# EAGLE design 808_hihat (EAGLE 7.2.0)
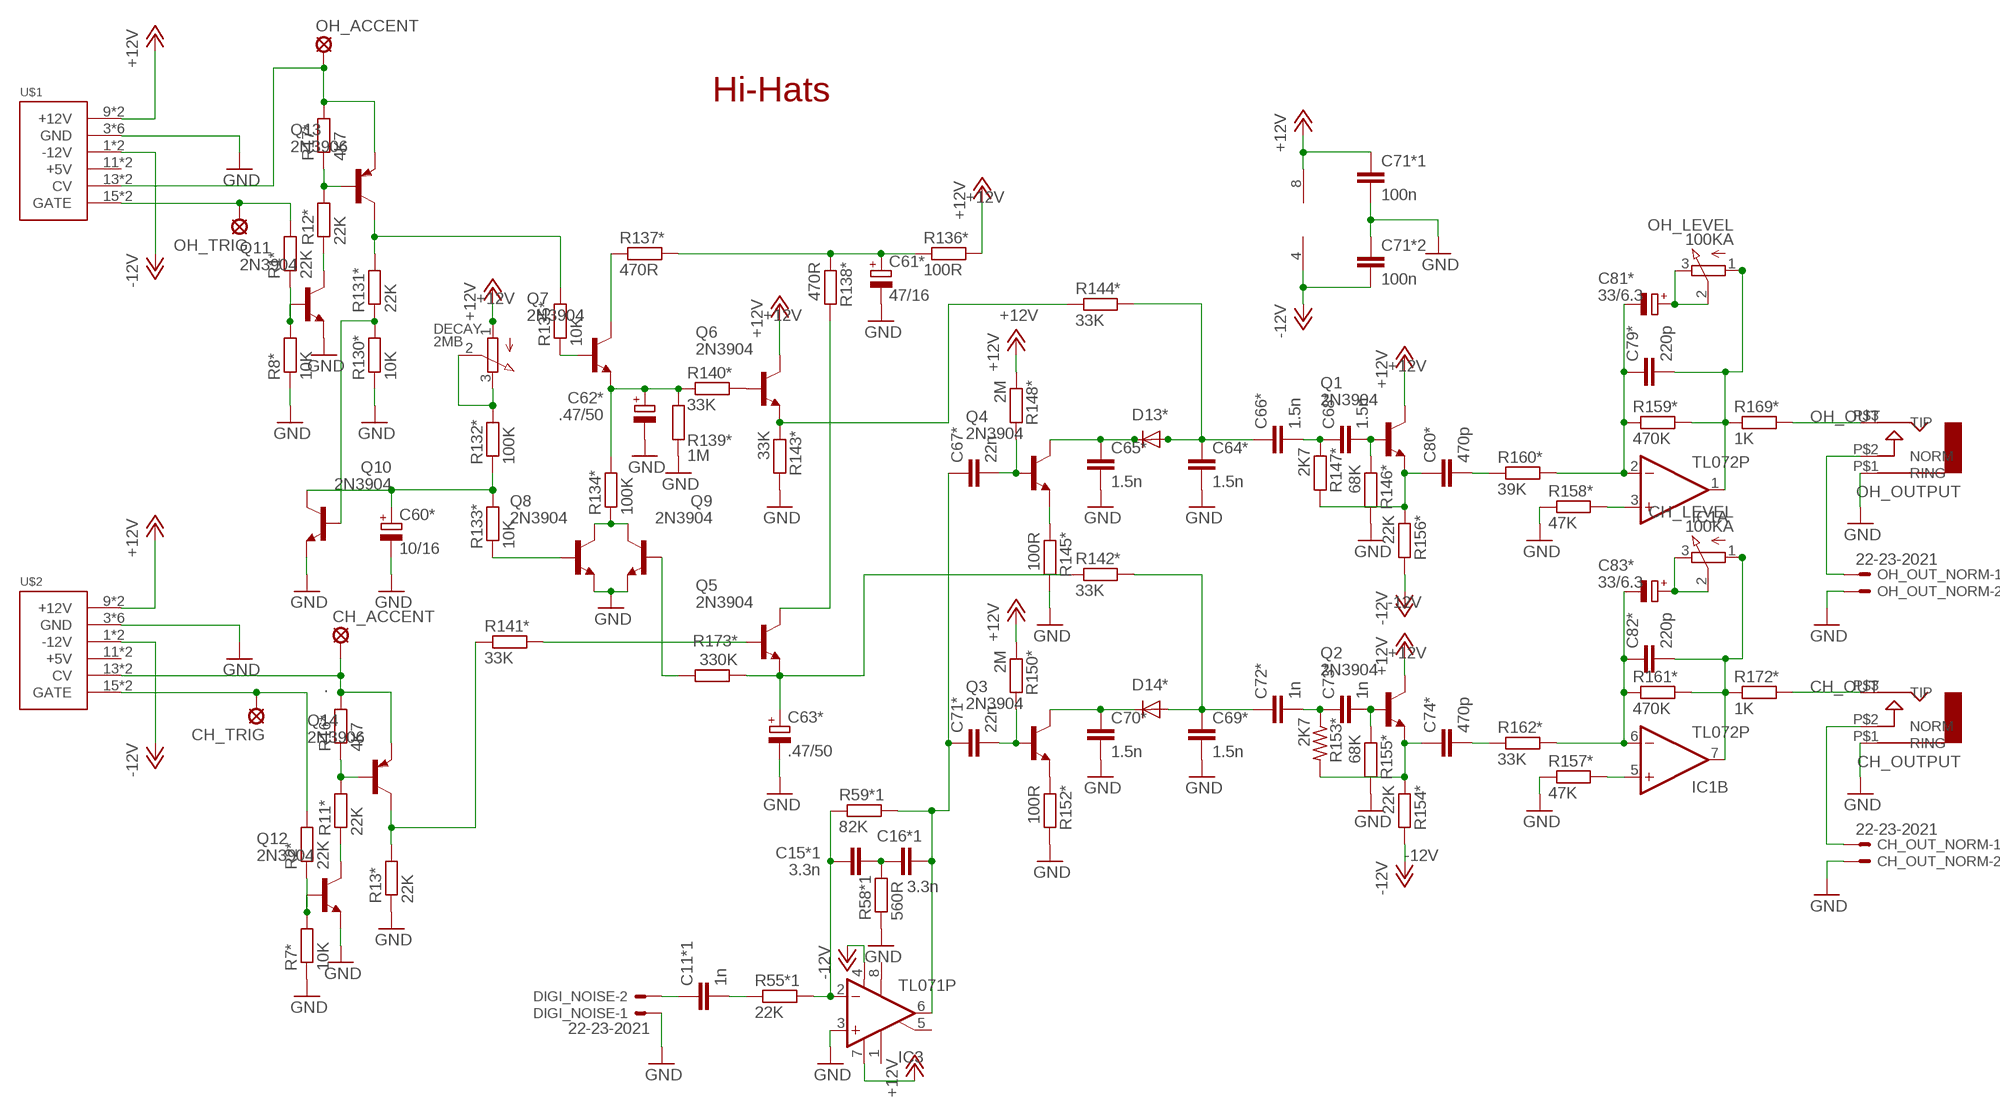
[diagram p0: schematic, sheet 1]

## Parts
C11*1  1n  C-EU3.5MM_PITCH  [C035-025X75]
C15*1  3.3n  C-EU050-024X044  [C050-024X044]
C16*1  3.3n  C-EU3.5MM_PITCH  [C035-025X75]
C60*  10/16  CPOL-EUE2.5-5  [E2,5-5]
C61*  47/16  CPOL-EUE2.5-5  [E2,5-5]
C62*  .47/50  CPOL-EUE2.5-5  [E2,5-5]
C63*  .47/50  CPOL-EUE2.5-5  [E2,5-5]
C64*  1.5n  C-EU050-024X044  [C050-024X044]
C65*  1.5n  C-EU3.5MM_PITCH  [C035-025X75]
C66*  1.5n  C-EU050-024X044  [C050-024X044]
C67*  22n  C-EU050-024X044  [C050-024X044]
C68*  1.5n  C-EU050-025X075  [C050-025X075]
C69*  1.5n  C-EU050-024X044  [C050-024X044]
C70*  1.5n  C-EU3.5MM_PITCH  [C035-025X75]
C71*  22n  C-EU4MM_PITCH  [C035-030X60]
C71*1  100n  C-EU050-024X044  [C050-024X044]
C71*2  100n  C-EU3MM_PITCH  [C030-025X75]
C72*  1n  C-EU050-024X044  [C050-024X044]
C73*  1n  C-EU050-024X044  [C050-024X044]
C74*  470p  C-EU050-025X075  [C050-025X075]
C79*  220p  C-EU025-025X050  [C025-025X050]
C80*  470p  C-EU050-024X044  [C050-024X044]
C81*  33/6.3  CPOL-EUE3.5-8  [E3,5-8]
C82*  220p  C-EU025-025X050  [C025-025X050]
C83*  33/6.3  CPOL-EUE2-5  [E2-5]
CH_ACCENT  LSP11  [LSP11]
CH_LEVEL  100KA  3RP/1610N  [3RP/1610N]
CH_OUT_NORM  22-23-2021  [22-23-2021]
CH_OUTPUT  AUDIO-JACK  [ERTHENVAR-JACK-90DEG]
CH_TRIG  LSP11  [LSP11]
D13*  1N4148DO35-10  [DO35-10]
D14*  1N4148DO35-10  [DO35-10]
DECAY  2MB  3RP/1610N  [3RP/1610N]
DIGI_NOISE  22-23-2021  [22-23-2021]
IC1  TL072P  [DIL08]
IC3  TL071P  [DIL08]
OH_ACCENT  LSP11  [LSP11]
OH_LEVEL  100KA  3RP/1610N  [3RP/1610N]
OH_OUT_NORM  22-23-2021  [22-23-2021]
OH_OUTPUT  AUDIO-JACK  [ERTHENVAR-JACK-90DEG]
OH_TRIG  LSP11  [LSP11]
Q1  2N3904  [TO92]
Q2  2N3904  [TO92]
Q3  2N3904  [TO92]
Q4  2N3904  [TO92]
Q5  2N3904  [TO92]
Q6  2N3904  [TO92]
Q7  2N3904  [TO92]
Q8  2N3904  [TO92]
Q9  2N3904  [TO92]
Q10  2N3904  [TO92]
Q11  2N3904  [TO92]
Q12  2N3904  [TO92]
Q13  2N3906  [TO92]
Q14  2N3906  [TO92]
R1*  22K  R-EU_0207/2V  [0207/2V]
R2*  22K  R-EU_0207/5V  [0207/5V]
R7*  10K  R-EU_0207/5V  [0207/5V]
R8*  10K  R-EU_0207/5V  [0207/5V]
R11*  22K  R-EU_0207/7  [0207/7]
R12*  22K  R-EU_0207/7  [0207/7]
R13*  22K  R-EU_0207/5V  [0207/5V]
R16*  4K7  R-EU_0207/5V  [0207/5V]
R17*  4K7  R-EU_0207/5V  [0207/5V]
R55*1  22K  R-EU_0207/5V  [0207/5V]
R58*1  560R  R-EU_0207/5V  [0207/5V]
R59*1  82K  R-EU_0207/7  [0207/7]
R130*  10K  R-EU_0207/7  [0207/7]
R131*  22K  R-EU_0207/5V  [0207/5V]
R132*  100K  R-EU_0207/5V  [0207/5V]
R133*  10K  R-EU_0207/7  [0207/7]
R134*  100K  R-EU_0207/7  [0207/7]
R135*  10K  R-EU_0207/7  [0207/7]
R136*  100R  R-EU_0207/5V  [0207/5V]
R137*  470R  R-EU_0207/5V  [0207/5V]
R138*  470R  R-EU_0207/5V  [0207/5V]
R139*  1M  R-EU_0207/5V  [0207/5V]
R140*  33K  R-EU_0207/7  [0207/7]
R141*  33K  R-EU_0207/5V  [0207/5V]
R142*  33K  R-EU_0207/5V  [0207/5V]
R143*  33K  R-EU_0207/5V  [0207/5V]
R144*  33K  R-EU_0207/5V  [0207/5V]
R145*  100R  R-EU_0207/5V  [0207/5V]
R146*  68K  R-EU_0207/7  [0207/7]
R147*  2K7  R-EU_0309/10  [0309/10]
R148*  2M  R-EU_0207/5V  [0207/5V]
R150*  2M  R-EU_0207/5V  [0207/5V]
R152*  100R  R-EU_0207/5V  [0207/5V]
R153*  2K7  R-US_0207/5V  [0207/5V]
R154*  22K  R-EU_0207/5V  [0207/5V]
R155*  68K  R-EU_0207/7  [0207/7]
R156*  22K  R-EU_0207/7  [0207/7]
R157*  47K  R-EU_0207/7  [0207/7]
R158*  47K  R-EU_0207/7  [0207/7]
R159*  470K  R-EU_0207/2V  [0207/2V]
R160*  39K  R-EU_0207/7  [0207/7]
R161*  470K  R-EU_0207/2V  [0207/2V]
R162*  33K  R-EU_0207/7  [0207/7]
R169*  1K  R-EU_0207/7  [0207/7]
R172*  1K  R-EU_0207/5V  [0207/5V]
R173*  330K  R-EU_0207/7  [0207/7]
U$1  POWER  [POWER_16]
U$2  POWER  [POWER_16]

## Nets
+12V: C71*1.1 DECAY.1(A) IC1.8(P:V+) IC3.7(V+) Q1.1(C) Q2.1(C) Q6.1(C) R136*.2 R148*.1 R150*.1 U$1.9(+12V) U$1.10(+12V) U$2.9(+12V) U$2.10(+12V)
-12V: C71*2.P$2 IC1.4(P:V-) IC3.4(V-) R154*.2 R156*.2 U$1.1(-12V) U$1.2(-12V) U$2.1(-12V) U$2.2(-12V)
.: CH_ACCENT.MP Q14.3(E) R16*.2 U$2.13(CV) U$2.14(CV)
CH_OUT: CH_OUTPUT.P$3(TIP) R172*.2
GND [GND]: C60*.- C61*.- C62*.- C63*.- C64*.2 C65*.P$2 C69*.2 C70*.P$2 C71*1.2 C71*2.P$1 CH_OUT_NORM.2 CH_OUTPUT.P$1(RING) DIGI_NOISE.1 IC3.3(+IN) OH_OUT_NORM.2 OH_OUTPUT.P$1(RING) Q8.3(E) Q9.3(E) Q10.3(E) Q11.3(E) Q12.3(E) R7*.1 R8*.1 R13*.1 R58*1.1 R130*.1 R139*.2 R143*.2 R145*.2 R146*.2 R152*.2 R155*.2 R157*.1 R158*.1 U$1.3(GND) U$1.4(GND) U$1.5(GND) U$1.6(GND) U$1.7(GND) U$1.8(GND) U$2.3(GND) U$2.4(GND) U$2.5(GND) U$2.6(GND) U$2.7(GND) U$2.8(GND)
N$1: DECAY.2(S) DECAY.3(E) R132*.2
N$2: C11*1.P$1 DIGI_NOISE.2
N$3: C11*1.P$2 R55*1.1
N$4: C15*1.1 IC3.2(-IN) R55*1.2 R59*1.1
N$5: C15*1.2 C16*1.P$1 R58*1.2
N$6: Q6.2(B) R140*.2
N$7: Q4.3(E) R145*.1
N$8: Q3.3(E) R152*.1
N$10: OH_OUT_NORM.1 OH_OUTPUT.P$2(NORM)
N$11: CH_OUT_NORM.1 CH_OUTPUT.P$2(NORM)
N$17: OH_ACCENT.MP Q13.3(E) R17*.2 U$1.13(CV) U$1.14(CV)
N$18: OH_TRIG.MP R1*.2 U$1.15(GATE) U$1.16(GATE)
N$20: IC1.3(A:+IN) R158*.2
N$21: IC1.5(B:+IN) R157*.2
N$25: CH_TRIG.MP R2*.2 U$2.15(GATE) U$2.16(GATE)
N$209: C81*.+ OH_LEVEL.2(S) OH_LEVEL.3(E)
N$219: C64*.1 C66*.1 D13*.A R144*.2
N$220: C69*.1 C72*.1 D14*.A R142*.2
N$375: C83*.+ CH_LEVEL.2(S) CH_LEVEL.3(E)
N$559: Q12.2(B) R2*.1 R7*.2
N$560: Q14.2(B) R11*.2 R16*.1
N$562: Q12.1(C) R11*.1
N$563: Q14.1(C) R13*.2 R141*.1
N$566: Q11.2(B) R1*.1 R8*.2
N$567: Q13.2(B) R12*.2 R17*.1
N$568: Q11.1(C) R12*.1
N$569: Q13.1(C) R131*.2 R135*.2
N$571: Q7.1(C) R137*.1
N$572: Q7.2(B) R135*.1
N$573: C62*.+ Q7.3(E) R134*.2 R139*.1 R140*.1
N$574: Q8.1(C) Q9.1(C) R134*.1
N$575: Q8.2(B) R133*.1
N$576: C60*.+ Q10.1(C) R132*.1 R133*.2
N$577: C61*.+ R136*.1 R137*.2 R138*.1
N$578: Q5.2(B) R141*.2
N$579: Q5.1(C) R138*.2
N$580: Q9.2(B) R173*.2
N$581: C63*.+ Q5.3(E) R142*.1 R173*.1
N$582: Q6.3(E) R143*.1 R144*.1
N$585: C71*.P$2 Q3.2(B) R150*.2
N$586: C67*.2 Q4.2(B) R148*.2
N$587: C70*.P$1 D14*.C Q3.1(C)
N$588: C65*.P$1 D13*.C Q4.1(C)
N$589: C66*.2 C68*.1 R147*.1
N$590: C72*.2 C73*.1 R153*.1
N$591: C68*.2 Q1.2(B) R146*.1
N$592: C73*.2 Q2.2(B) R155*.1
N$595: C74*.2 R162*.1
N$597: C80*.2 R160*.1
N$598: C79*.1 C81*.- IC1.2(A:-IN) R159*.1 R160*.2
N$600: C79*.2 IC1.1(A:OUT) OH_LEVEL.1(A) R159*.2 R169*.1
N$601: C82*.1 C83*.- IC1.6(B:-IN) R161*.1 R162*.2
N$603: C82*.2 CH_LEVEL.1(A) IC1.7(B:OUT) R161*.2 R172*.1
N$604: Q10.2(B) R130*.2 R131*.1
N$607: C80*.1 Q1.3(E) R147*.2 R156*.1
N$608: C74*.1 Q2.3(E) R153*.2 R154*.1
OH_OUT: OH_OUTPUT.P$3(TIP) R169*.2
TO_HH: C16*1.P$2 C67*.1 C71*.P$1 IC3.6(OUT) R59*1.2
Unconnected: IC3.1(ON1) IC3.5(ON2) IC3.8(OPT) U$1.11(+5V) U$1.12(+5V) U$2.11(+5V) U$2.12(+5V)

## Notes on the sheet
- Hi-Hats

## Library data of the parts
C11*1 C15*1 C16*1 C64* C65* C66* C67* C68* C69* C70* C71* C71*1 C71*2 C72* C73* C74* C79* C80* C82* = TR808clone:C-EU: CAPACITOR, European symbol Pitch 3mm
C60* C61* C62* C63* C81* C83* = TR808clone:CPOL-EU: POLARIZED CAPACITOR, European symbol
CH_ACCENT CH_TRIG OH_ACCENT OH_TRIG = solpad:LSP11: SOLDER PAD drill 1.1 mm
CH_LEVEL DECAY OH_LEVEL = pot:3RP/1610N: 16mm Potentiometer one level Source: http://www.alphapotentiometers.net/html/16mm_pot_2.html
CH_OUT_NORM DIGI_NOISE OH_OUT_NORM = con-molex:22-23-2021: .100" (2.54mm) Center Header - 2 Pin; MF: MOLEX; MPN: 22-23-2021; OC_FARNELL: 1462926; OC_NEWARK: 25C3832
CH_OUTPUT OH_OUTPUT = erthenvar:AUDIO-JACK: Switching Mono 3.5mm Audio Jack from Erthenvar.
D13* D14* = TR808clone:1N4148: DIODE high speed (Philips)
IC1 = linear:TL072: OP AMP
IC3 = 808_lt:TL071: OP AMP
Q1-Q12 = 808_lt:2N3904: NPN Transistor
Q13 Q14 = 808_lt:2N3906: PNP Transistor
R1* R2* R7* R8* R11* R12* R13* R16* R17* R55*1 R58*1 R59*1 R130* R131* R132* R133* R134* R135* R136* R137* R138* R139* R140* R141* R142* R143* R144* R145* R146* R147* R148* R150* R152* R154* R155* R156* R157* R158* R159* R160* R161* R162* R169* R172* R173* = TR808clone:R-EU_: RESISTOR, European symbol
R153* = rcl:R-US_: RESISTOR, American symbol
U$1 U$2 = eurorack:POWER

## Net classes
0 default: width 0.635 mm, drill 0.254 mm, clearance 0.254 mm
1 GND: width 1.016 mm, drill 1.016 mm, clearance 0.508 mm
2 Power: width 1.016 mm, drill 1.016 mm, clearance 0.508 mm
3 special: width 0.635 mm, drill 0.254 mm, clearance 0.254 mm
4 15v: width 1.524 mm, drill 1.016 mm, clearance 0.508 mm

## Board
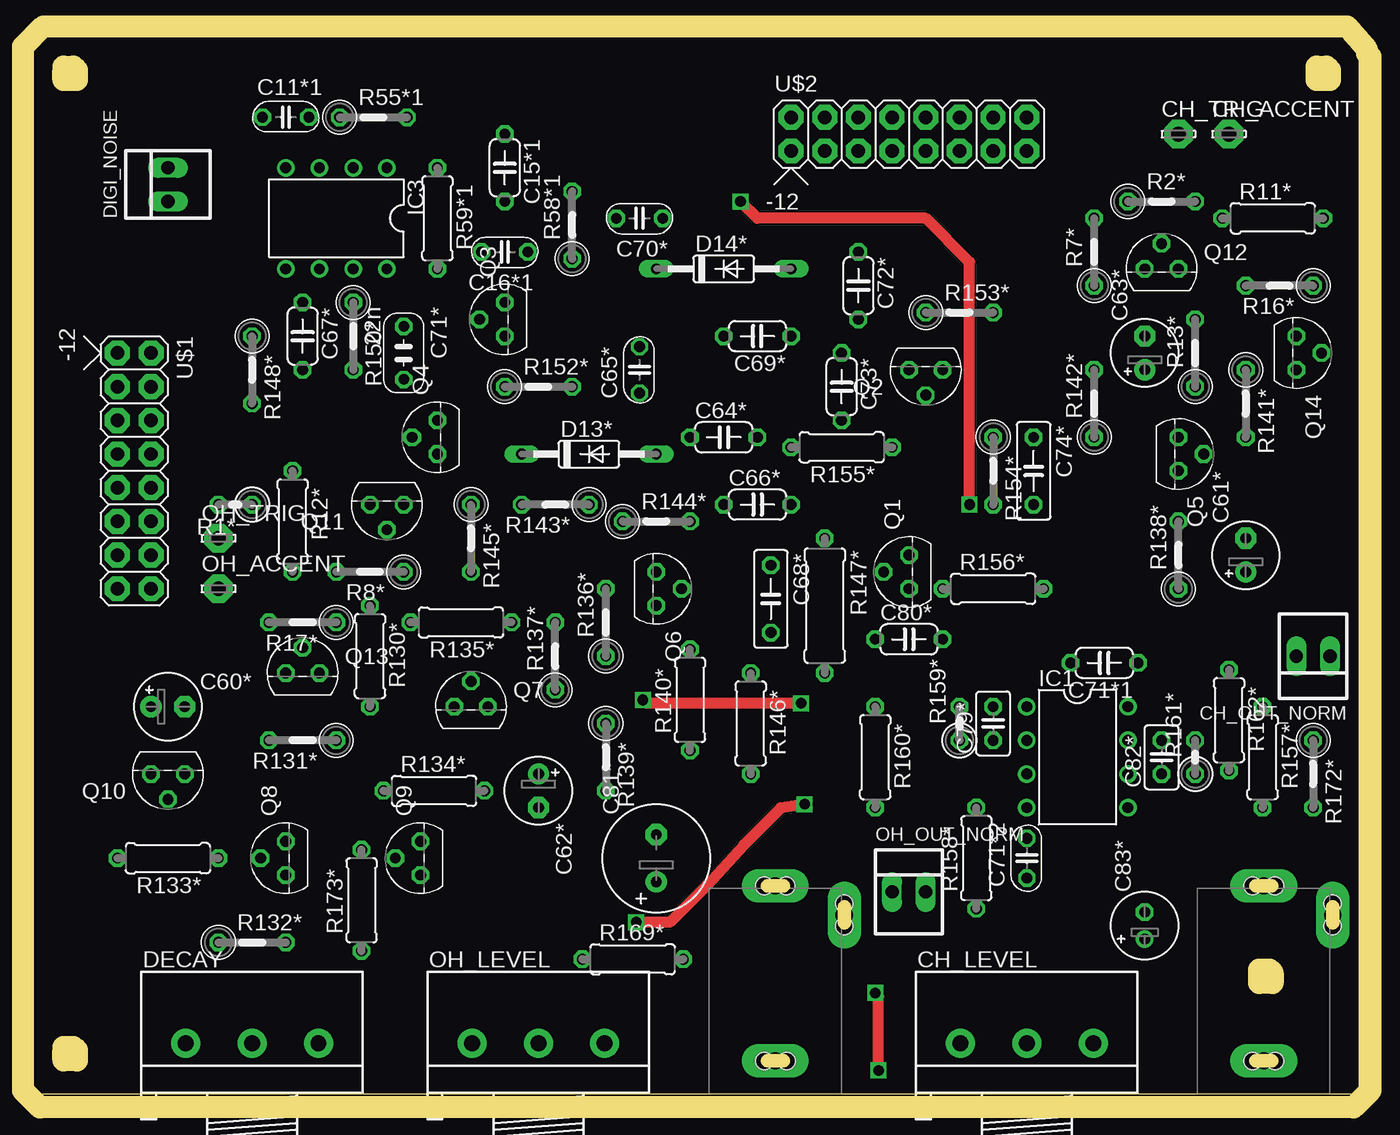
[diagram p1: board, top side]
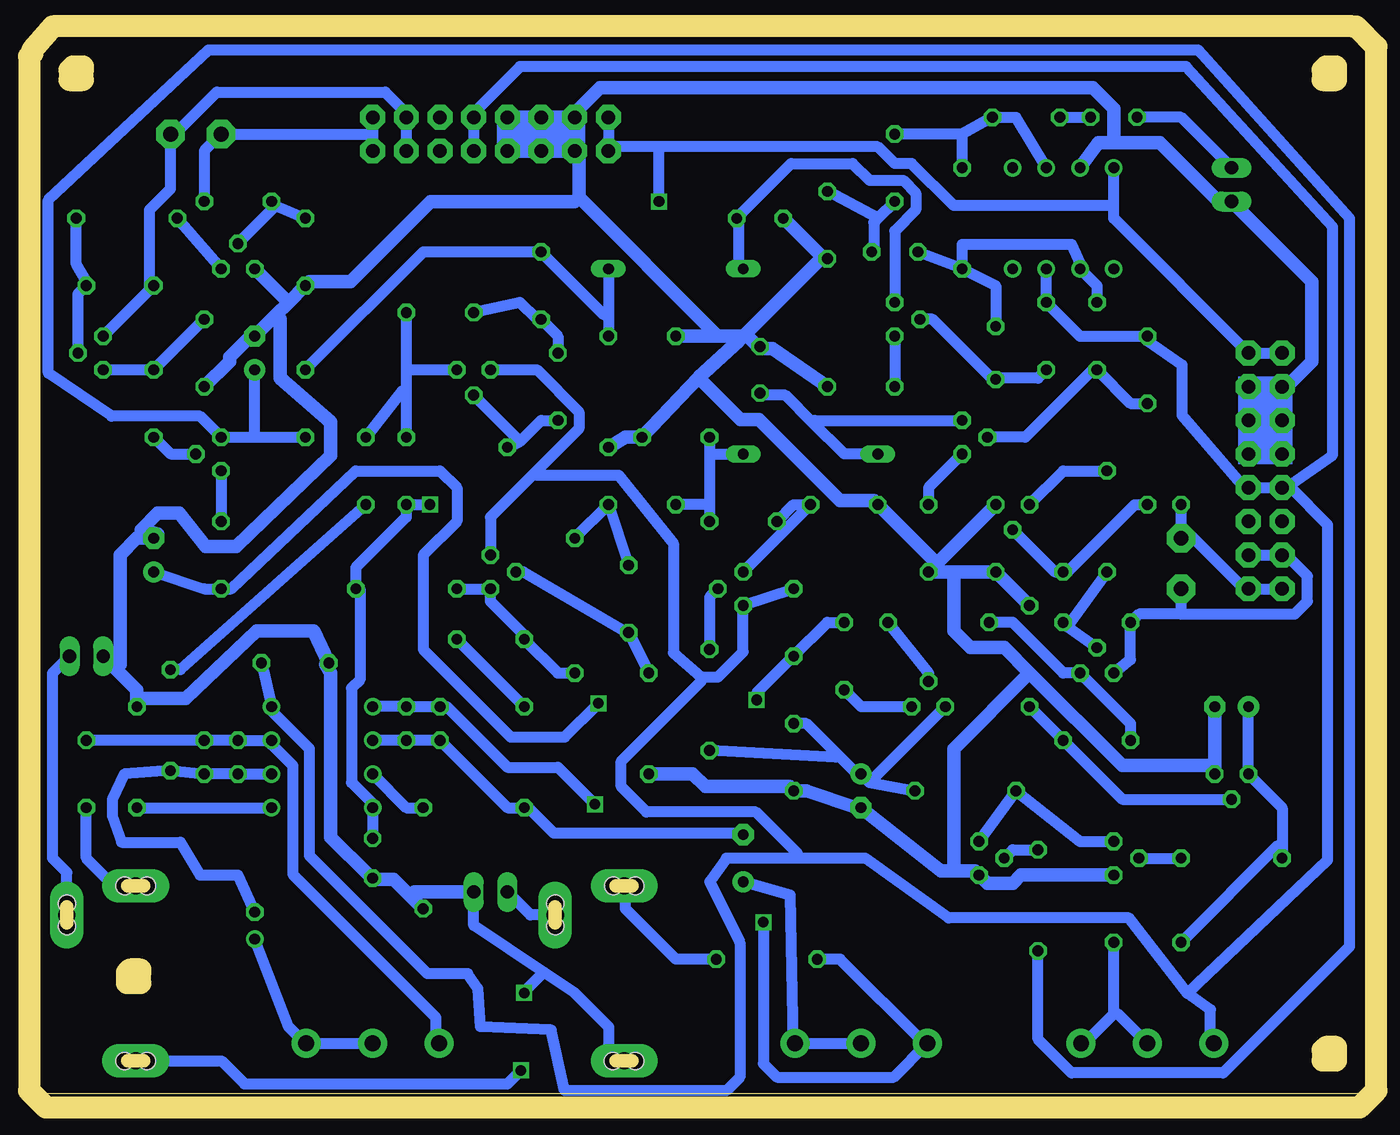
[diagram p2: board, bottom side, seen from below]

Size 100 x 80 mm. Coordinates in mm from the lower left corner, seen from the top.
Outline: 0,0 100,0 100,80 0,80 0,0
Copper layers (1*16): Top 0.035mm / dielectric 1.5mm / Bottom 0.035mm
Design rules "default *": minimum track width 32mil, minimum drill 31mil, track to track 18mil, track to pad 18mil, pad to pad 18mil, via to via 18mil, smd to smd 8mil, copper to edge 0mil, drill to drill 18mil, minimum pad ring 10mil, minimum via ring 8mil, stop-mask expansion 4mil, vias tented up to drill 0mil, thermal gap 10mil
Milling: 30 lines

### Footprints (pad centres in the part's own frame; a part is rotated, then mirrored left to right if it is on the bottom)
C035-025X75 = drill 0.8 octagon: P$1 -1.75,0; P$2 1.75,0
C050-024X044 = drill 0.813 octagon: 1 -2.54,0; 2 2.54,0
E2,5-5 = drill 0.813 pad 1.6: + -1.27,0 | drill 0.813 pad 1.6 octagon: - 1.27,0
C050-025X075 = drill 0.813 octagon: 1 -2.54,0; 2 2.54,0
C035-030X60 = drill 0.8 octagon: P$1 -2,0; P$2 2,0
C030-025X75 = drill 0.8 octagon: P$1 -1.5,0; P$2 1.5,0
C025-025X050 = drill 0.813 octagon: 1 -1.27,0; 2 1.27,0
E3,5-8 = drill 0.813 pad 1.6: + -1.778,0 | drill 0.813 pad 1.6 octagon: - 1.778,0
E2-5 = drill 0.813 pad 1.27: + -1.016,0 | drill 0.813 pad 1.27 octagon: - 1.016,0
LSP11 = drill 1.118 pad 2.159 octagon: MP 0,0
3RP/1610N = drill 1.2 pad 2.184: 1 -5,0; 2 0,0; 3 5,0
22-23-2021 = drill 1 long: 1 -1.27,0; 2 1.27,0
ERTHENVAR-JACK-90DEG = drill 1.3 pad 2.54 long: P$1 5,-2.5; P$2 -0.2,-13.5; P$3 5,-15.7 | hole 1.3: 5.842,-2.489; 4.14,-2.489; -0.203,-12.649; -0.203,-14.351; 5.842,-15.697; 4.166,-15.697
DO35-10 = drill 0.813 long: A 5.08,0; C -5.08,0
DIL08 = drill 0.813 pad 1.27: 1 -3.81,-3.81; 2 -1.27,-3.81; 3 1.27,-3.81; 4 3.81,-3.81; 5 3.81,3.81; 6 1.27,3.81; 7 -1.27,3.81; 8 -3.81,3.81
TO92 = drill 0.813 octagon: 1 1.27,0; 2 0,1.905; 3 -1.27,0
0207/2V = drill 0.813 octagon: 1 -1.27,0; 2 1.27,0
0207/5V = drill 0.813 octagon: 1 -2.54,0; 2 2.54,0
0207/7 = drill 0.813 octagon: 1 -3.81,0; 2 3.81,0
0309/10 = drill 0.813 octagon: 1 -5.08,0; 2 5.08,0
POWER_16 = drill 1.016 pad 1.88 octagon: 1 -6.35,-1.27; 2 -6.35,1.27; 3 -3.81,-1.27; 4 -3.81,1.27; 5 -1.27,-1.27; 6 -1.27,1.27; 7 1.27,-1.27; 8 1.27,1.27; 9 3.81,-1.27; 10 3.81,1.27; 11 6.35,-1.27; 12 6.35,1.27; 13 8.89,-1.27; 14 8.89,1.27; 15 11.43,-1.27; 16 11.43,1.27

### Placement (x,y rotation side)
C11*1  19.05,73.66 0 top
C15*1  35.56,69.85 270 top
C16*1  35.56,63.5 180 top
C60*  10.16,29.21 0 top
C61*  91.44,40.64 90 top
C62*  38.1,22.86 270 top
C63*  83.82,55.88 90 top
C64*  52.07,49.53 0 top
C65*  45.72,54.61 90 top
C66*  54.61,44.45 0 top
C67*  20.32,57.15 270 top
C68*  55.63,37.34 270 top
C69*  54.61,57.15 180 top
C70*  45.72,66.04 180 top
C71*  27.94,55.88 270 top
C71*1  80.77,32.51 180 top
C71*2  74.93,17.78 90 top
C72*  62.23,60.96 270 top
C73*  60.96,53.34 270 top
C74*  75.44,46.99 270 top
C79*  72.39,27.94 90 top
C80*  66.04,34.29 0 top
C81*  46.99,17.78 90 top
C82*  85.09,25.4 90 top
C83*  83.82,12.7 90 top
CH_ACCENT  90.17,72.39 0 top
CH_LEVEL  74.93,3.81 0 top
CH_OUT_NORM  96.52,33.02 180 top
CH_OUTPUT  97.79,0 180 top
CH_TRIG  86.36,72.39 0 top
D13*  41.91,48.26 0 top
D14*  52.07,62.23 0 top
DECAY  16.51,3.81 0 top
DIGI_NOISE  10.16,68.58 90 top
IC1  78.74,25.4 270 top
IC3  22.86,66.04 180 top
OH_ACCENT  13.97,38.1 0 top
OH_LEVEL  38.1,3.81 0 top
OH_OUT_NORM  66.04,15.24 0 top
OH_OUTPUT  60.96,0 180 top
OH_TRIG  13.97,41.91 0 top
Q1  66.04,39.37 90 top
Q2  67.31,54.61 180 top
Q3  35.56,58.42 90 top
Q4  30.48,49.53 90 top
Q5  86.36,48.26 270 top
Q6  46.99,38.1 270 top
Q7  33.02,29.21 0 top
Q8  19.05,17.78 90 top
Q9  29.21,17.78 90 top
Q10  10.16,24.13 180 top
Q11  26.67,44.45 180 top
Q12  85.09,62.23 0 top
Q13  20.32,31.75 0 top
Q14  95.25,55.88 270 top
R1*  15.24,44.45 180 top
R2*  85.09,67.31 0 top
R7*  80.01,63.5 90 top
R8*  25.4,39.37 180 top
R11*  93.47,66.04 0 top
R12*  19.56,43.18 270 top
R13*  87.63,55.88 90 top
R16*  93.98,60.96 180 top
R17*  20.32,35.56 180 top
R55*1  25.65,73.66 0 top
R58*1  40.64,65.53 90 top
R59*1  30.48,66.04 270 top
R130*  25.4,33.02 270 top
R131*  20.32,26.67 180 top
R132*  16.51,11.43 0 top
R133*  10.16,17.78 180 top
R134*  30.23,22.86 0 top
R135*  32.26,35.56 180 top
R136*  43.18,35.56 90 top
R137*  39.37,33.02 90 top
R138*  86.36,40.64 90 top
R139*  43.18,25.4 270 top
R140*  49.53,29.72 90 top
R141*  91.44,52.07 270 top
R142*  80.01,52.07 90 top
R143*  39.37,44.45 180 top
R144*  46.99,43.18 0 top
R145*  33.02,41.91 270 top
R146*  54.1,27.94 270 top
R147*  59.69,36.83 270 top
R148*  16.51,54.61 270 top
R150*  24.13,57.15 270 top
R152*  38.1,53.34 0 top
R153*  69.85,58.93 0 top
R154*  72.39,46.99 270 top
R155*  60.96,48.77 180 top
R156*  72.39,38.1 0 top
R157*  92.71,25.4 270 top
R158*  71.12,17.78 90 top
R159*  69.85,27.94 90 top
R160*  63.5,25.4 270 top
R161*  87.63,25.4 90 top
R162*  90.17,28.19 270 top
R169*  45.21,10.16 0 top
R172*  96.52,24.13 270 top
R173*  24.77,14.61 90 top
U$1  7.62,49.53 270 top
U$2  63.5,72.39 0 top

### Tracks (layer width: path | path; a pad name or v marks a point on that pad's centre or on a via)
+12V
  Bottom 0.813: U$2.9 U$2.10 67.31,73.98 63.82,77.47 13.59,77.47 2.54,65.41 2.54,48.2 6.03,45.72 U$1.9 | U$1.9 U$1.10 9.21,45.72 13.91,51.18 13.91,54.99 16.51,56.83 R148*.1 21.59,57.15 R150*.1 IC3.7 | R136*.2 Q6.1 46.99,33.34 48.9,31.43 50.16,31.43 | Q1.1 66.04,43.5 62.71,46.83 | 62.71,46.83 59.37,50.16 59.37,51.44 62.55,54.61 Q2.1 | 50.16,31.43 52.26,33.27 52.26,41.53 56.39,46.67 62.55,46.67 62.71,46.83 | C71*1.1 IC1.8 82.55,28.89 79.69,26.04 79.69,17.97 70.8,9.08 67.75,9.08 66.99,7.94 66.8,5.08 61.47,4.83 60.45,0.25 48.26,0.25 47.24,1.27 47.24,11.43 49.53,16 48.26,17.78 42.86,17.78 | 42.86,17.78 37.78,17.78 31.5,13.27 17.91,13.27 13.49,7.59 | 13.49,7.59 11.75,6.35 11.75,3.81 DECAY.1 11.43,3.81 | 50.16,31.43 50.16,31.11 56.2,25.08 56.2,23.18 54.29,21.27 46.04,21.27 42.86,18.1 42.86,17.78 | 13.49,7.59 2.92,17.65 2.92,42.93 5.71,45.72 U$1.9
-12V  (via drill 0.8)
  Top 0.813: v70.61,44.45 70.61,62.74 67.31,66.04 54.61,66.04 v53.34,67.31
  Bottom 0.813: C71*2.P$2 IC1.4 74.93,21.91 76.52,23.5 76.52,30.61 75.88,31.24 75.88,38.1 R156*.2 76.2,39.69 72.39,43.5 R154*.2 v70.61,44.45 | U$2.2 U$2.1 56.83,71.44 53.34,71.44 | 19.05,66.99 19.05,66.04 U$1.2 U$1.1 | 19.05,66.99 IC3.4 | 53.34,71.44 36.83,71.44 35.56,70.17 34.29,70.17 31.11,66.99 19.05,66.99 | v53.34,67.31 53.34,71.44
.
  Bottom 0.813: U$2.13 U$2.14 72.39,73.98 73.98,75.56 86.68,75.56 89.85,72.39 CH_ACCENT.MP 90.17,68.26 91.76,66.67 91.76,60.96 R16*.2 Q14.3
CH_OUT
  Bottom 0.813: CH_OUTPUT.P$3 94.44,15.7 96.52,17.78 R172*.2
GND  (via drill 0.8)
  Top 0.813: v63.75,1.78 63.75,7.37 v63.5,7.62
  Bottom 0.813: OH_OUTPUT.P$1 57.11,2.5 57.11,5.04 59.69,7.62 62.03,9.18 | 62.03,9.18 67.31,12.7 OH_OUT_NORM.2 | CH_OUTPUT.P$1 86.32,2.5 84.58,0.76 64.77,0.76 v63.75,1.78 | v63.5,7.62 63.5,7.72 62.03,9.18
  Bottom 1.016: Q8.3 26.04,16.51 26.67,15.88 28.57,15.88 Q9.3 29.53,16.83 31.11,16.83 | R146*.2 50.8,24.13 49.85,23.18 43.5,23.18 R139*.2 42.23,22.86 38.42,21.59 C62*.- 32.07,16.83 31.11,16.83 | C60*.- 11.43,24.77 | 11.43,24.77 Q10.3 | R130*.1 R8*.1 31.11,39.37 | 31.11,39.37 R145*.2 32.38,40.01 | 32.38,40.01 Q11.3 | 32.38,40.01 R143*.2 37.15,44.77 39.69,44.77 45.78,50.86 47.18,50.86 50.35,54.04 | 11.43,24.77 18.41,24.77 25.4,31.75 | 25.4,31.75 27.3,33.66 29.84,33.66 31.11,34.92 31.11,39.37 | 31.11,16.83 31.11,26.04 25.4,31.75 | 92.71,29.84 92.71,30.48 94.3,32.07 | 92.71,29.84 R157*.1 | CH_OUT_NORM.2 94.3,32.07 | 94.3,32.07 93.98,32.38 93.98,40.64 92.71,41.91 C61*.- 91.12,42.23 92.39,42.55 91.12,43.81 89.53,43.81 87.5,41.27 85.22,41.27 78.11,48.13 78.11,50.67 81.92,53.98 81.92,58.42 82.23,58.74 | R158*.1 72.07,14.92 | 72.07,14.92 73.34,16.19 74.93,16.19 C71*2.P$1 75.25,16.51 78.11,19.37 78.11,31.75 78.49,32.38 C71*1.2 79.38,34.92 83.69,34.92 89.03,29.84 92.71,29.84 | OH_OUT_NORM.2 71.75,15.24 72.07,14.92 | U$1.5 U$1.7 U$1.8 | U$1.5 U$1.6 | U$1.5 U$1.3 | U$1.3 U$1.4 | IC3.3 20.19,71.75 19.05,71.75 | 19.05,71.75 15.56,71.75 11.11,67.31 DIGI_NOISE.1 4.13,61.28 4.13,55.24 5.71,53.66 6.03,53.66 U$1.3 | R13*.1 85.72,55.24 85.72,55.56 84.14,57.15 C63*.- 82.23,58.74 | 82.23,58.74 81.28,59.69 | 81.28,59.69 R7*.1 79.69,61.28 76.58,61.28 70.55,67.31 59.69,67.31 59.37,67.63 | 81.28,59.69 Q12.3 | U$2.4 U$2.3 | U$2.3 U$2.5 U$2.7 | U$2.4 U$2.6 U$2.8 | C70*.P$2 42.93,65.02 41.02,63.12 | R58*1.1 41.02,63.12 | R155*.2 55.88,49.53 C64*.2 50.35,54.04 | R152*.2 44.77,56.2 45.72,56.2 C65*.P$2 46.04,56.52 46.67,57.15
  Bottom 1.016: 46.67,57.15 47.31,57.15 | 47.31,57.15 49.21,57.15 | 49.21,57.15 C69*.2 | 50.35,54.04 47.31,56.83 47.31,57.15 | 41.02,63.12 46.67,57.47 46.67,57.15 | 59.37,67.63 59.37,70.8 U$2.3 | 59.37,67.63 49.21,57.47 49.21,57.15 | 19.05,71.75 19.05,74.3 20.64,75.88 57.78,75.88 59.69,73.98 U$2.4
N$1
  Bottom 0.813: 19.05,6.03 R132*.2 | 19.05,6.03 21.27,3.81 DECAY.3 21.59,3.81 | DECAY.2 18.73,6.03 19.05,6.03
N$2
  Bottom 0.813: C11*1.P$1 13.97,73.66 DIGI_NOISE.2
N$3
  Bottom 0.813: R55*1.1 C11*1.P$2
N$4
  Bottom 0.813: IC3.2 26.42,73.66 R55*1.2 30.48,72.39 | 30.48,72.39 R59*1.1 | 30.48,72.39 C15*1.1
N$5
  Bottom 0.813: C15*1.2 36.83,66.04 | 36.83,66.04 37.15,65.72 37.15,63.5 C16*1.P$1 | 36.83,66.04 R58*1.2
N$6
  Bottom 0.813: R140*.2 49.53,37.47 Q6.2
N$7
  Bottom 0.813: R145*.1 33.02,45.72 Q4.3
N$8
  Bottom 0.813: Q3.3 R152*.1
N$10
  Bottom 0.813: OH_OUTPUT.P$2 63.03,13.5 OH_OUT_NORM.1
N$11
  Bottom 0.813: CH_OUTPUT.P$2 97.99,16.71 99.06,17.78 99.06,31.75 CH_OUT_NORM.1
N$17
  Bottom 0.813: U$1.14 U$1.13 6.03,40.64 4.45,39.05 4.45,37.15 5.4,36.2 13.97,36.2 | Q13.3 17.78,32.77 R17*.2 17.14,36.2 13.97,36.2 | 13.97,36.2 OH_ACCENT.MP
N$18
  Bottom 0.813: U$1.15 U$1.16 9.21,38.1 13.65,42.55 OH_TRIG.MP R1*.2
N$20
  Bottom 0.813: R158*.2 72.39,21.59 IC1.3
N$21
  Bottom 0.813: R157*.2 IC1.5
N$25
  Bottom 0.813: U$2.16 74.93,72.39 | 74.93,72.39 U$2.15 | R2*.2 87.63,71.12 CH_TRIG.MP 74.93,72.39
N$209
  Bottom 0.813: C81*.+ 43.43,14.99 43.18,3.81 OH_LEVEL.3 OH_LEVEL.2
N$219
  Bottom 0.813: C64*.1 49.53,48.26 | 49.53,48.26 49.53,44.45 | 49.53,44.45 R144*.2 | 49.53,48.26 D13*.A | 49.53,44.45 C66*.1
N$220
  Bottom 0.813: D14*.A 57.15,58.74 | 57.15,58.74 C69*.1 | 57.15,58.74 57.47,58.74 C72*.1 71.12,63.5 R142*.2
N$375
  Bottom 0.813: C83*.+ 81.28,5.08 80.01,3.81 CH_LEVEL.3 CH_LEVEL.2
N$559
  Bottom 0.813: 82.23,66.99 R7*.2 | 82.23,66.99 Q12.2 | 82.23,66.99 R2*.1
N$560
  Bottom 0.813: Q14.2 97.16,60.33 R16*.1 96.52,61.28 97.28,62.55 R11*.2
N$562
  Bottom 0.813: R11*.1 Q12.1
N$563
  Bottom 0.813: Q14.1 R141*.1 R13*.2
N$566
  Bottom 0.813: Q11.2 23.5,39.37 R8*.2 22.54,39.37 17.46,44.45 R1*.1
N$567
  Bottom 0.813: R12*.2 22.54,35.24 | 22.54,35.24 R17*.1 | 22.54,35.24 Q13.2
N$568
  Bottom 0.813: R12*.1 22.86,46.99 Q11.1
N$569
  Bottom 0.813: R131*.2 17.78,27.94 Q13.1 22.86,31.75 26.67,35.56 R135*.2
N$571
  Bottom 0.813: Q7.1 38.1,29.21 R137*.1
N$572
  Bottom 0.813: Q7.2 33.02,31.75 R135*.1
N$573
  Bottom 0.813: 37.47,23.5 C62*.+ 38.42,24.13 39.85,25.56 | 37.47,23.5 R134*.2 | R139*.1 42.23,27.94 39.85,25.56 | R140*.1 40.01,25.4 39.85,25.56 | 37.47,23.5 Q7.3
N$574
  Bottom 0.813: Q8.1 21.59,19.05 R134*.1 Q9.1
N$575
  Bottom 0.813: Q8.2 R133*.1
N$576
  Bottom 0.813: 6.35,18.73 6.35,21.59 Q10.1 C60*.+ | 6.35,18.73 R133*.2 | R132*.1 6.67,18.73 6.35,18.73
N$577  (via drill 0.8)
  Top 0.813: v57.91,29.46 46.23,29.46 v45.97,29.72
  Bottom 0.813: R137*.2 40.64,35.56 R136*.1 45.97,30.23 v45.97,29.72 | C61*.+ 87.63,38.1 R138*.1 85.6,38.1 76.2,46.99 69.85,46.99 68.58,45.72 68.58,43.18 71.12,40.64 71.12,33.53 64.52,26.92 60.45,26.92 v57.91,29.46
N$578
  Bottom 0.813: Q5.2 90.17,48.26 R141*.2
N$579
  Bottom 0.813: Q5.1 R138*.2
N$580
  Bottom 0.813: R173*.2 26.67,18.41 Q9.2
N$581
  Bottom 0.813: R173*.1 24.77,4.13 22.23,1.59 10.79,1.59 1.27,11.11 1.27,66.04 12.7,78.74 87.31,78.74 99.38,67.44 99.38,54.36 94.61,51.12 87.95,51.12 Q5.3 83.82,49.53 | 83.82,49.53 R142*.1 | 83.82,49.53 C63*.+
N$582
  Bottom 0.813: R144*.1 43.18,44.45 R143*.1 Q6.3
N$585
  Bottom 0.813: R150*.2 24.77,53.98 27.94,53.98 C71*.P$2 28.26,53.98 32.7,58.42 Q3.2
N$586
  Bottom 0.813: R148*.2 17.78,52.07 C67*.2 20.64,54.61 25.72,49.53 Q4.2
N$587
  Bottom 0.813: D14*.C 47.31,62.55 47.31,66.04 C70*.P$1 47.5,66.04 43.37,70.17 38.73,70.17 37.47,68.9 34.92,68.9 33.97,67.94 33.97,66.67 35.56,65.09 Q3.1
N$588
  Bottom 0.813: 41.75,50.64 39.37,48.26 D13*.C | 41.75,50.64 43.81,52.7 45.72,52.7 C65*.P$1 | Q4.1 41.59,50.8 41.75,50.64
N$589
  Bottom 0.813: C68*.1 C66*.2 R147*.1
N$590
  Bottom 0.813: C73*.1 60.96,57.15 C72*.2 62.55,58.42 63.82,59.69 R153*.1
N$591
  Bottom 0.813: R146*.1 C68*.2 56.2,35.05 63.56,39.37 Q1.2
N$592
  Bottom 0.813: C73*.2 62.23,50.8 63.82,49.21 | R155*.1 63.82,49.21 | 63.82,49.21 Q2.2
N$595
  Bottom 0.813: R162*.1 89.41,32 C74*.2
N$597
  Bottom 0.813: C80*.2 R160*.1
N$598
  Bottom 0.813: IC1.2 C79*.1 R159*.1 64.77,21.59 R160*.2 63.18,21.59 61.28,19.68 46.99,19.68 C81*.-
N$600  (via drill 0.8)
  Top 0.813: v58.17,21.84 56.39,21.59 53.59,18.8 50.8,15.75 48.01,12.95 v45.47,12.95
  Bottom 0.813: IC1.1 C79*.2 R159*.2 69.34,29.21 64.77,24.64 60.96,24.64 v58.17,21.84 | R169*.1 39.69,10.16 33.34,3.81 OH_LEVEL.1 | 33.02,3.81 OH_LEVEL.1 | v45.47,12.95 45.47,2.29 44.45,1.27 35.64,1.27 OH_LEVEL.1
N$601
  Bottom 0.813: IC1.6 C82*.1 R161*.1 R162*.2 93.66,24.13 94.55,22.23 94.55,20.95 93.85,18.99 89.41,18.99 87.95,16.51 85.09,16.51 C83*.-
N$603
  Bottom 0.813: 69.85,3.81 CH_LEVEL.1 70.17,4.13 70.17,5.78 80.96,16.57 80.96,24.77 82.55,26.35 IC1.7 C82*.2 R161*.2 R172*.1
N$604
  Bottom 0.813: Q10.2 18.41,22.23 R131*.1 R130*.2
N$607
  Bottom 0.813: R156*.1 Q1.3 66.04,37.15 63.5,34.61 C80*.1 60.96,31.75 R147*.2
N$608
  Bottom 0.813: R153*.2 72.39,54.61 | 72.39,54.61 72.39,53.02 | 72.39,53.02 R154*.1 | C74*.1 72.71,53.02 72.39,53.02 | 72.39,54.61 Q2.3
OH_OUT
  Bottom 0.813: R169*.2 52.07,10.16 55.88,13.97 55.88,15.62 OH_OUTPUT.P$3
TO_HH
  Bottom 0.813: C67*.1 20.32,60.96 IC3.6 21.4,62.23 22.23,64.07 30.48,64.07 R59*1.2 | C71*.P$1 27.94,60.96 R59*1.2 | R59*1.2 C16*1.P$2
(copper drawn outside any net)
  shapes: Bottom area x2